# EAGLE design V60_Roco_69377_21MTC_J2_014_01_05 (EAGLE 5.10)
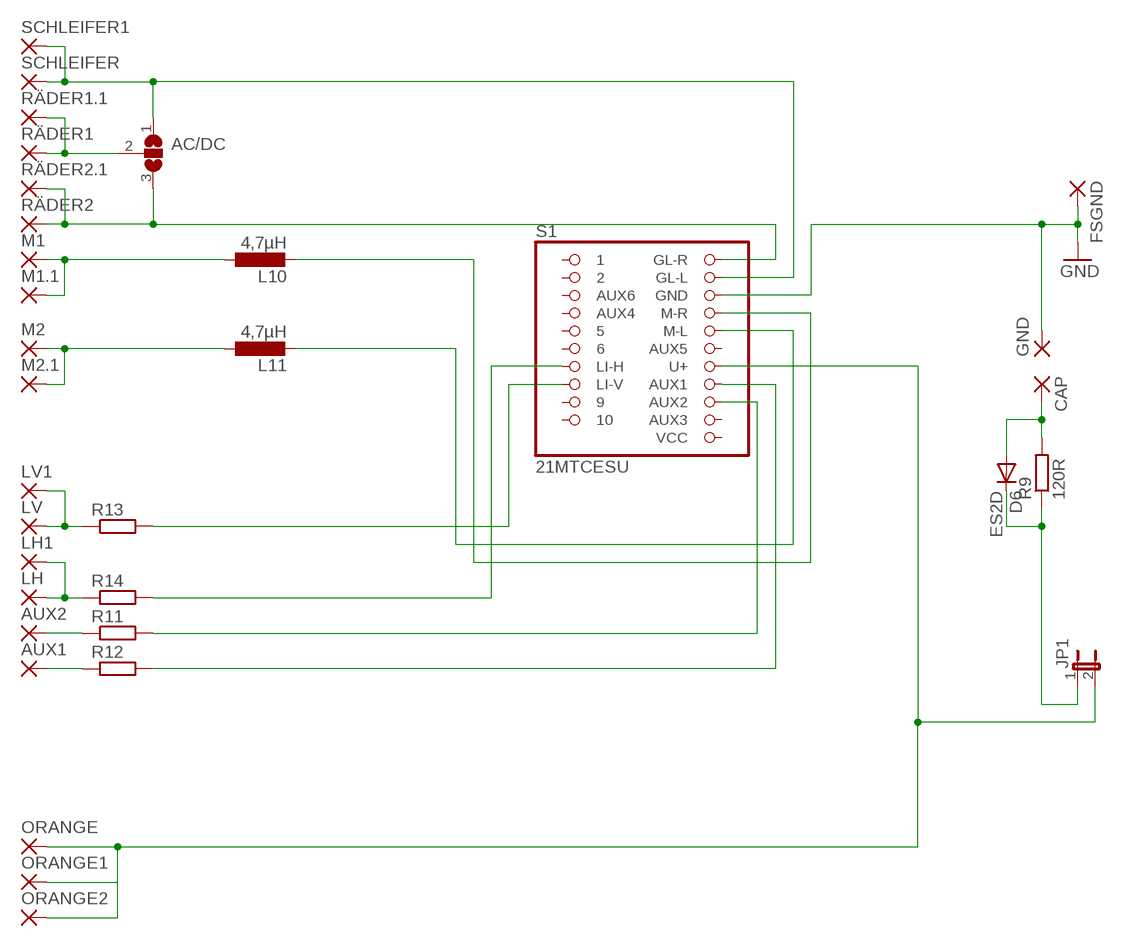
[diagram p0: schematic, sheet 1]

## Parts
AC/DC  SJ2W1  [SJ_2.1]
AUX1  SMD-RECT1,27  [SMD1,27-1,27]
AUX2  SMD-RECT1,27  [SMD1,27-1,27]
CAP  SMD2  [SMD1,27-2,54]
D6  ES2D  [SMB]
FSGND  SMD2  [SMD1,27-2,54]
GND  SMD2  [SMD1,27-2,54]
JP1  JP1E2,00R  [JP1_2R]
L10  4,7µH  L-EUL1212  [L1212]
L11  4,7µH  L-EUL1212  [L1212]
LH  SMD2  [SMD1,27-2,54]
LH1  SMD-RECT1,27  [SMD1,27-1,27]
LV  SMD2  [SMD1,27-2,54]
LV1  SMD-RECT1,27  [SMD1,27-1,27]
M1  SMD2  [SMD1,27-2,54]
M1.1  SMD-RECT1,27  [SMD1,27-1,27]
M2  SMD2  [SMD1,27-2,54]
M2.1  SMD-RECT1,27  [SMD1,27-1,27]
ORANGE  SMD2  [SMD1,27-2,54]
ORANGE1  SMD2  [SMD1,27-2,54]
ORANGE2  SMD-RECT1,27  [SMD1,27-1,27]
R9  120R  R-EU_R0603S  [R0603S]
R11  R-EU_R0603S  [R0603S]
R12  R-EU_R0603S  [R0603S]
R13  R-EU_R0603S  [R0603S]
R14  R-EU_R0603S  [R0603S]
RÄDER1  SMD2  [SMD1,27-2,54]
RÄDER1.1  SMD-RECT1,27  [SMD1,27-1,27]
RÄDER2  SMD2  [SMD1,27-2,54]
RÄDER2.1  SMD-RECT1,27  [SMD1,27-1,27]
S1  21MTCESU  [21MTC_SMD_ESU]
SCHLEIFER  SMD2  [SMD1,27-2,54]
SCHLEIFER1  SMD-RECT1,27  [SMD1,27-1,27]

## Nets
BL: L11.2 S1.P18(M-L)
BLAU: L10.1 M1.1(P) M1.1.1(P)
CAP: D6.C JP1.1 R9.1
GN: L10.2 S1.P19(M-R)
GND: FSGND.1(P) GND.1(P) S1.P20(GND)
GRÜN: L11.1 M2.1(P) M2.1.1(P)
N$1: R11.2 S1.P14(AUX2)
N$2: R12.2 S1.P15(AUX1)
N$3: AUX2.1(P) R11.1
N$4: AUX1.1(P) R12.1
N$5: LV1.1(P) LV.1(P) R13.1
N$6: LH1.1(P) LH.1(P) R14.1
N$7: CAP.1(P) D6.A R9.2
N$16: R13.2 S1.P8(LI-V)
N$20: R14.2 S1.P7(LI-H)
ORANGE: JP1.2 ORANGE1.1(P) ORANGE2.1(P) ORANGE.1(P) S1.P16(U+)
RÄDER: AC/DC.3 RÄDER2.1(P) RÄDER2.1.1(P) S1.P22(GL-R)
RÄDER2: AC/DC.2 RÄDER1.1(P) RÄDER1.1.1(P)
SCHLEIFER: AC/DC.1 S1.P21(GL-L) SCHLEIFER1.1(P) SCHLEIFER.1(P)
Unconnected: S1.P1 S1.P2 S1.P3(AUX6) S1.P4(AUX4) S1.P5 S1.P6 S1.P9 S1.P10 S1.P13(AUX3) S1.P17(AUX5)

## Power pins joined to a net without a drawn wire
VCC: S1.P12(VCC)

## Library data of the parts
AC/DC = jumper:SJ2
AUX1 AUX2 LH1 LV1 M1.1 M2.1 ORANGE2 RÄDER1.1 RÄDER2.1 SCHLEIFER1 = wirepad:SMD-RECT
CAP FSGND GND LH LV M1 M2 ORANGE ORANGE1 RÄDER1 RÄDER2 SCHLEIFER = wirepad:SMD2: SMD PAD
D6 = diode:ES2D: DIODE super fast rectifier, 2 A
JP1 = jumper:JP1E: JUMPER
L10 L11 = rcl:L-EU: INDUCTOR, European symbol
R9 R11-R14 = rcl:R-EU_: RESISTOR, European symbol
S1 = pinhead:21MTC

## Board
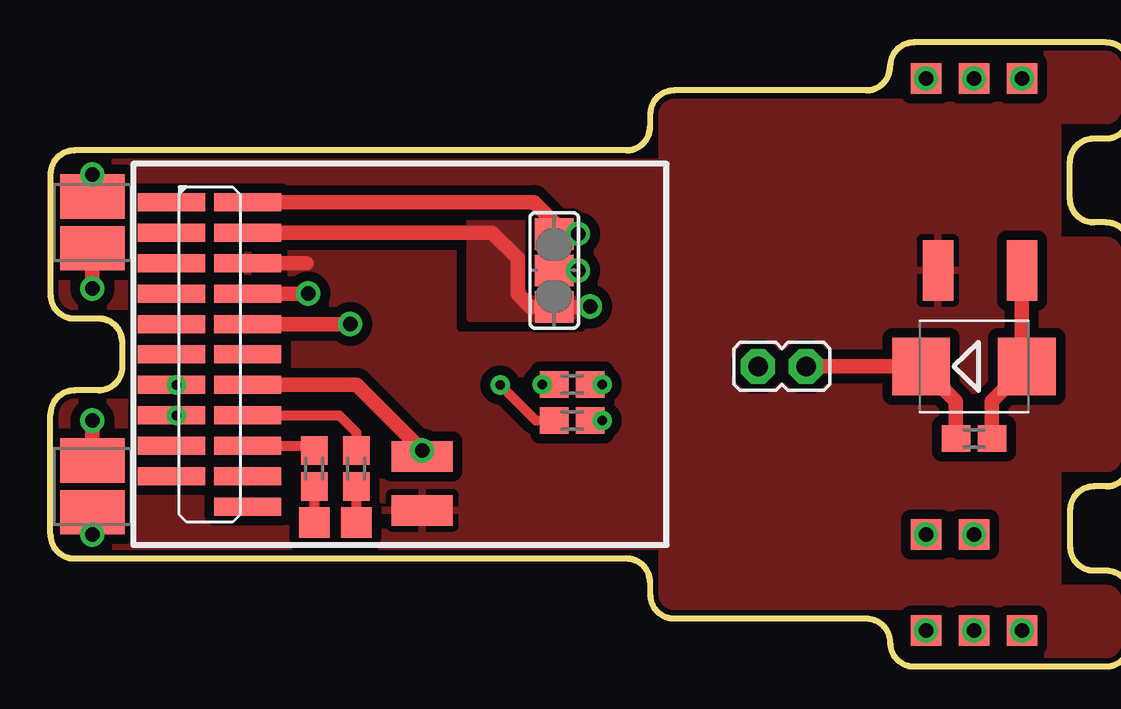
[diagram p1: board, top side]
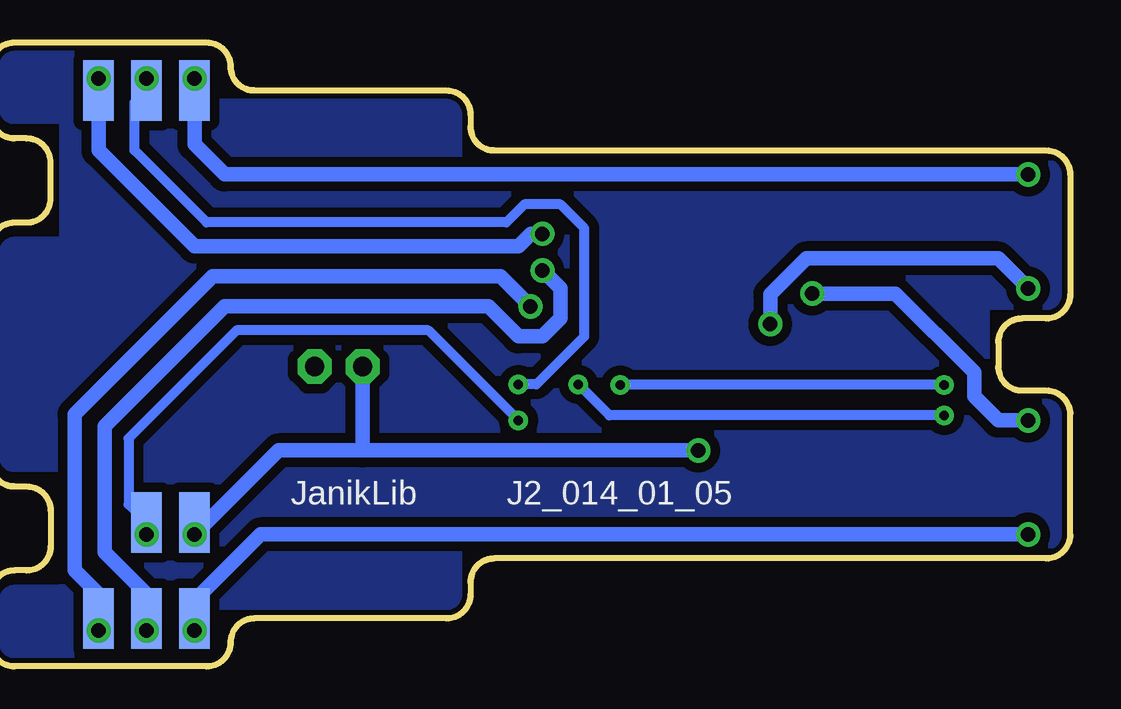
[diagram p2: board, bottom side, seen from below]

No outline drawn. Coordinates in mm, seen from the top.
Copper layers (1*16): Top 0.035mm / dielectric 1.5mm / Bottom 0.035mm
Design rules "default *": minimum track width 10mil, minimum drill 0.4mm, track to track 8mil, track to pad 8mil, pad to pad 8mil, via to via 8mil, smd to smd 8mil, copper to edge 40mil, drill to drill 8mil, minimum pad ring 10mil, minimum via ring 8mil, stop-mask expansion 4mil, vias tented up to drill 0mil, thermal gap 10mil
tKeepout: area 42.5,-5.5 to 45,5.5
bKeepout: area 37,-2 to 45,2; area 27.5,-2 to 37,2; area 9.5,-5 to 27.5,5; area 0,-8.5 to 9.5,8.5
Milling: 53 lines

### Footprints (pad centres in the part's own frame; a part is rotated, then mirrored left to right if it is on the bottom)
SJ_2.1 = smd 1.321 x 1.6: 1 -1.524,0; 2 0,0; 3 1.524,0
SMD1,27-1,27 = smd 1.27 x 1.27: 1 0,0
SMD1,27-2,54 = smd 1.27 x 2.54: 1 0,0
SMB = smd 2.4 x 2.4: A 2.2,0; C -2.2,0
JP1_2R = drill 0.8 pad 1.422 octagon: 1 0,-1; 2 0,1
L1212 = smd 1.85 x 2.7: 1 -1.075,0; 2 1.075,0
R0603S = smd 1.2 x 1.1: 1 -0.75,0; 2 0.75,0
21MTC_SMD_ESU = smd 0.75 x 2.8: P1 -6.35,-0.953; P2 -5.08,-0.953; P3 -3.81,-0.953; P4 -2.54,-0.953; P5 -1.27,-0.953; P6 0,-0.953; P7 1.27,-0.953; P8 2.54,-0.953; P9 3.81,-0.953; P10 5.08,-0.953; P12 6.35,2.223; P13 5.08,2.223; P14 3.81,2.223; P15 2.54,2.223; P16 1.27,2.223; P17 0,2.223; P18 -1.27,2.223; P19 -2.54,2.223; P20 -3.81,2.223; P21 -5.08,2.223; P22 -6.35,2.223

### Placement (x,y rotation side)
AC/DC  21,3.5 90 top
AUX1  12.75,-7 270 top
AUX2  11,-7 270 top
CAP  40.5,3.5 0 top
D6  38.5,-0.5 0 top
FSGND  15.5,-6.5 270 top
GND  37,3.5 0 top
JP1  30.5,-0.5 90 top
L10  1.75,-5.5 90 top
L11  1.75,5.5 270 top
LH  38.5,-7 180 bottom
LH1  38.5,-7.5 90 top
LV  38.5,11 0 bottom
LV1  38.5,11.5 0 top
M1  36.5,-11 180 bottom
M1.1  36.5,-11.5 0 top
M2  36.5,11 0 bottom
M2.1  36.5,11.5 0 top
ORANGE  15.5,-4.25 90 top
ORANGE1  36.5,-7 180 bottom
ORANGE2  36.5,-7.5 90 top
R9  38.5,-3.5 0 top
R11  11,-4.75 90 top
R12  12.75,-4.75 90 top
R13  21.75,-1.25 180 top
R14  21.75,-2.75 180 top
RÄDER1  38.5,-11 180 bottom
RÄDER1.1  38.5,-11.5 0 top
RÄDER2  40.5,11 180 bottom
RÄDER2.1  40.5,11.5 0 top
S1  6,0 270 top
SCHLEIFER  40.5,-11 180 bottom
SCHLEIFER1  40.5,-11.5 0 top

### Tracks (layer width: path | path; a pad name or v marks a point on that pad's centre or on a via)
BL  (via drill 0.6)
  Top 0.61: v12.5,1.27 S1.P18 | L11.2 v1.75,2.75
  Bottom 0.61: v12.5,1.27 12.5,2.5 11,4 3,4 v1.75,2.75
BLAU  (via drill 0.6)
  Top 0.61: L10.1 v1.75,-7.5
  Bottom 0.61: M1.1 M1.1.1 36.5,-10.25 33.75,-7.5 v1.75,-7.5
  other vias: 36.5,-11.5
CAP
  Top 0.61: JP1.1 D6.C 37.75,-1.95 R9.1
GN  (via drill 0.6)
  Top 0.61: 8.26,2.5 S1.P19 v10.75,2.54 | v1.75,-2.75 L10.2
  Bottom 0.61: v10.75,2.54 7.29,2.54 4,-0.75 4,-1.75 3,-2.75 v1.75,-2.75
GND
  Top 0.61: S1.P20 10.69,3.81 | FSGND.1 16,-6.25
  pour Bottom (isolate 0.406): 0.5,-7.5 0.5,-2.5 arc-90 1,-2 3.5,-2 3.5,2 1,2 arc-90 0.5,2.5 0.5,7.5 arc-90 1,8 25.5,8 25.5,10 arc-90 26,10.5 35.5,10.5 35.5,12 arc-90 36,12.5 44,12.5 arc-90 44.5,12 44.5,10.25 arc-90 44,9.75 42,9.75 42,4.75 44,4.75 arc-90 44.5,4.25 44.5,-4.25 arc-90 44,-4.75 42,-4.75 42,-9.75 44,-9.75 arc-90 44.5,-10.25 44.5,-12 arc-90 44,-12.5 36,-12.5 arc-90 35.5,-12 35.5,-10.5 26,-10.5 arc-90 25.5,-10 25.5,-8 1,-8 arc-90
  pour Top (isolate 0.406, rank 2): 0.5,-7.5 0.5,-2.5 arc-90 1,-2 3.5,-2 3.5,2 1,2 arc-90 0.5,2.5 0.5,7.5 arc-90 1,8 25.5,8 25.5,10 arc-90 26,10.5 35.5,10.5 35.5,12 arc-90 36,12.5 44,12.5 arc-90 44.5,12 44.5,10.25 arc-90 44,9.75 42,9.75 42,4.75 44,4.75 arc-90 44.5,4.25 44.5,-4.25 arc-90 44,-4.75 42,-4.75 42,-9.75 44,-9.75 arc-90 44.5,-10.25 44.5,-12 arc-90 44,-12.5 36,-12.5 arc-90 35.5,-12 35.5,-10.5 26,-10.5 arc-90 25.5,-10 25.5,-8 1,-8 arc-90
GRÜN  (via drill 0.6)
  Top 0.61: L11.1 v1.75,7.5
  Bottom 0.61: M2.1.1 M2.1 36.5,8.75 35.25,7.5 v1.75,7.5
  other vias: 36.5,11.5
N$1
  Top 0.406: S1.P14 10.81,-3.81 R11.2
N$2
  Top 0.406: S1.P15 12.04,-2.54 12.75,-3.25 R12.2
N$3
  Top 0.406: R11.1 AUX2.1
N$4
  Top 0.406: R12.1 AUX1.1
N$5  (via drill 0.4, 0.6)
  Top 0.406: v23,-1.25 R13.1
  Bottom 0.406: LV1.1 LV.1 39,10.5 39,8.5 36,5.5 23.5,5.5 22.75,6.25 21.25,6.25 20.25,5.25 20.25,0.75 22.25,-1.25 v23,-1.25
  other vias: 38.5,11.5
N$6  (via drill 0.4, 0.6)
  Top 0.406: R14.1 v23,-2.75
  Bottom 0.406: v23,-2.75 26.75,1 34.75,1 39.25,-3.5 39.25,-6.25 LH.1 LH1.1
  other vias: 38.5,-7.5
N$7
  Top 0.61: R9.2 39.25,-1.95 D6.A 40.5,-0.3 CAP.1
N$16  (via drill 0.4)
  Top 0.406: S1.P8 v5.25,-2.54 | v20.5,-1.25 R13.2
  Bottom 0.406: v20.5,-1.25 19.21,-2.54 v5.25,-2.54
N$20  (via drill 0.4)
  Top 0.406: S1.P7 v5.25,-1.27 | v18.75,-1.27 20.23,-2.75 R14.2
  Bottom 0.406: v5.25,-1.27 v18.75,-1.27
ORANGE  (via drill 0.6)
  Top 0.61: S1.P16 12.77,-1.27 v15.5,-4 ORANGE.1
  Bottom 0.61: v15.5,-4 29.5,-4 | 29.5,-4 JP1.2 | ORANGE1.1 ORANGE2.1 33,-4 29.5,-4
  other vias: 36.5,-7.5
RÄDER  (via drill 0.6)
  Top 0.61: v22,5.02 AC/DC.3 21,5.5 20.15,6.35 S1.P22
  Bottom 0.61: RÄDER2.1 40.5,10.25 | v22,5.02 22.48,5.02 23,4.5 36.5,4.5 40.5,8.5 RÄDER2.1 | RÄDER2.1 RÄDER2.1.1
  other vias: 40.5,11.5
RÄDER2  (via drill 0.6)
  Top 0.61: v22,3.5 AC/DC.2
  Bottom 0.61: RÄDER1.1 RÄDER1.1.1 38.5,-10 40.25,-8.25 40.25,-3 35.25,2 24.25,2 23,0.75 22,0.75 21.25,1.5 21.25,2.75 v22,3.5
  other vias: 38.5,-11.5
SCHLEIFER  (via drill 0.6)
  Top 0.61: v22.5,2 21.98,1.98 AC/DC.1 20.02,1.98 19.5,2.5 19.5,4 18.42,5.08 S1.P21
  Bottom 0.61: SCHLEIFER.1 SCHLEIFER1.1 40.5,-10 41.5,-9 41.5,-2.5 35.75,3.25 23.75,3.25 v22.5,2
  other vias: 40.5,-11.5
  pour Top (isolate 0.406, no thermals): 21.75,2.5 19.75,2.5 19.75,5.5 17.5,5.5 17.5,1.5 21.75,1.5

### Text on the board
bNames: J2_014_01_05 | JanikLib
tStop: M | V | R | 21MTC | design by Janik Merz | C- | C+ | AC | Roco V60 | DC | LV | CJ | + | LH | GND | + | H | M | R | S
bStop: design by Janik Merz | 63377 | 69377 | Roco V60